# EAGLE schematic 60-db25-cable (EAGLE 6.6.0)
AUTHOR: Sean Leavey; COMPANY: Institute for Gravitational Research; DATE: 2016-03-30; DESCRIPTION: Male-Female; INFOSETTINGS: Used by 'info.ulp' - do not edit manually! |FileTime=2015-02-02, 13:18:38|FileVersion=2||[LabelBox]|Company=Institute for Gravitational Research|Title=DB9 CABLE|Description=DB9 Cable Male-Female|Revision=2015-02-02|Date=2015-02-02|Author=S. Steinlechner|RevisionDate1=|RevisionAuthor1=|RevisionDate2=|RevisionAuthor2=|RevisionDate3=|RevisionAuthor3=|RevisionDate4=|RevisionAuthor4=|RevisionDate5=|RevisionAuthor5=||[FrontMatter]|DocTitle=|SubTitle=|Authors=|Keywords=|Abstract=|LaTeXSyntax=0||[Safety]|VoltageHazard=-1|HeatHazard=-1|Convection=0|ForcedAir=0|WaterCooling=0|LightHazard=-1|LaserPower=1000|LaserWavelength=1064|LaserClass=6|LightPower=1000|LightInvisible=0||[Notes]|Machinery=-1|IntendedUsers=-1|DisplayHints=1|; TITLE: DB25 Cable
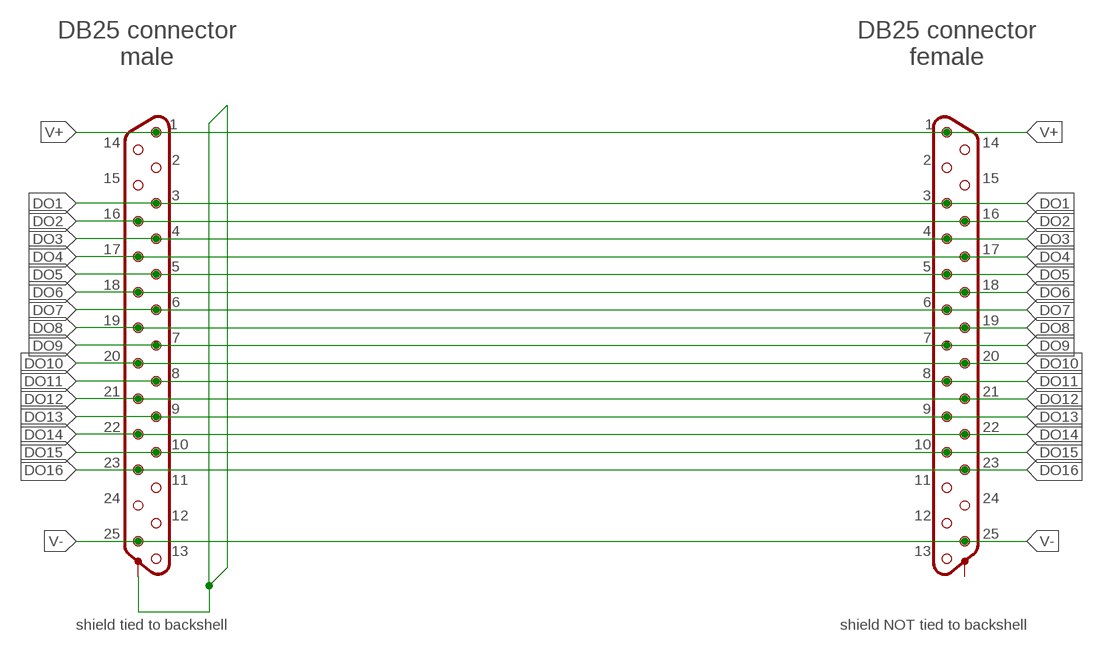
[diagram p0: schematic, sheet 1]

## Parts
X11  XDSUB25-SHIELD  [DUMMY26]
X12  XDSUB25-SHIELD  [DUMMY26]

## Nets
DO1: X11.3 X12.3
DO2: X11.16 X12.16
DO3: X11.4 X12.4
DO4: X11.17 X12.17
DO5: X11.5 X12.5
DO6: X11.18 X12.18
DO7: X11.6 X12.6
DO8: X11.19 X12.19
DO9: X11.7 X12.7
DO10: X11.20 X12.20
DO11: X11.8 X12.8
DO12: X11.21 X12.21
DO13: X11.9 X12.9
DO14: X11.22 X12.22
DO15: X11.10 X12.10
DO16: X11.23 X12.23
N$1: X11.26(S)
V+: X11.1 X12.1
V-: X11.25 X12.25
Unconnected: X11.2 X11.11 X11.12 X11.13 X11.14 X11.15 X11.24 X12.2 X12.11 X12.12 X12.13 X12.14 X12.15 X12.24 X12.26(S)

## Notes on the sheet
- DB25 connector
  male
- DB25 connector
  female
- shield tied to backshell | shield NOT tied to backshell

## Library data of the parts
X11 X12 = symbols:XDSUB25-SHIELD: D-Sub connector, 25 pins, with shield; SPICE: <ignore>